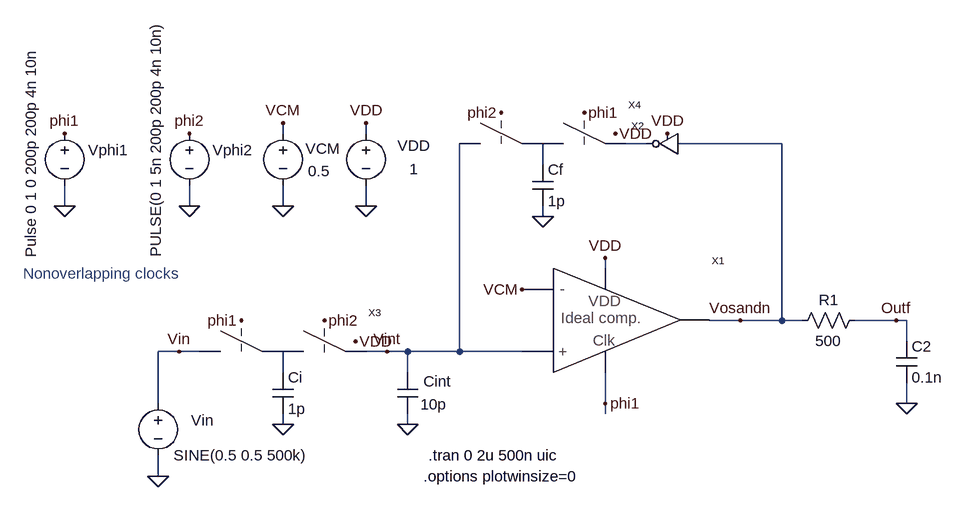
[diagram p0: schematic _Fig6_21_MSD.asc]
_Fig6_21_MSD.asc, the LTspice schematic file:
Version 4
SHEET 1 880 680
WIRE -400 -176 -400 -192
WIRE -272 -176 -272 -192
WIRE 160 -160 128 -160
WIRE 368 -160 208 -160
WIRE 0 -128 0 -160
WIRE -736 -64 -736 -96
WIRE -544 -64 -544 -96
WIRE -400 -64 -400 -96
WIRE -272 -64 -272 -96
WIRE 0 -48 0 -64
WIRE 96 32 96 16
WIRE 304 112 256 112
WIRE 368 112 368 -160
WIRE 368 112 304 112
WIRE 400 112 368 112
WIRE 544 112 480 112
WIRE 560 112 544 112
WIRE 560 144 560 112
WIRE -560 160 -592 160
WIRE -528 160 -560 160
WIRE -240 160 -272 160
WIRE -208 160 -240 160
WIRE -128 160 -128 -160
WIRE -128 160 -208 160
WIRE -32 160 -128 160
WIRE -400 192 -400 160
WIRE -208 192 -208 160
WIRE -592 240 -592 160
WIRE 96 240 96 192
WIRE 560 240 560 208
WIRE 96 256 96 240
WIRE -400 272 -400 256
WIRE -208 272 -208 256
WIRE -592 352 -592 320
FLAG -272 -64 0
FLAG 96 16 VDD
FLAG -272 -192 VDD
FLAG -400 -64 0
FLAG -400 -192 VCM
FLAG 304 112 Vosandn
FLAG -208 272 0
FLAG -592 352 0
FLAG -560 160 Vin
FLAG -240 160 Vint
FLAG 560 240 0
FLAG 544 112 Outf
FLAG -32 64 VCM
FLAG 192 -176 VDD
FLAG 0 -48 0
FLAG -400 272 0
FLAG 112 -176 VDD
FLAG -288 144 VDD
FLAG -736 -64 0
FLAG -736 -176 phi1
FLAG -544 -64 0
FLAG -544 -176 phi2
FLAG -464 112 phi1
FLAG 64 -208 phi1
FLAG -64 -208 phi2
FLAG -336 112 phi2
FLAG 96 240 phi1
SYMBOL Ideal_clocked_comparator 16 112 R0
SYMATTR InstName X1
SYMBOL voltage -272 -192 R0
WINDOW 0 48 35 Left 0
WINDOW 3 67 71 Left 0
SYMATTR InstName VDD
SYMATTR Value 1
SYMBOL voltage -400 -192 R0
WINDOW 0 35 39 Left 0
WINDOW 3 39 74 Left 0
SYMATTR InstName VCM
SYMATTR Value 0.5
SYMBOL cap -224 192 R0
WINDOW 0 40 14 Left 0
WINDOW 3 36 49 Left 0
SYMATTR InstName Cint
SYMATTR Value 10p
SYMBOL voltage -592 224 R0
WINDOW 0 51 42 Left 0
WINDOW 123 0 0 Left 0
WINDOW 39 0 0 Left 0
SYMATTR InstName Vin
SYMATTR Value SINE(0.5 0.5 500k)
SYMBOL res 496 96 R90
WINDOW 0 0 56 VBottom 0
WINDOW 3 32 56 VTop 0
SYMATTR InstName R1
SYMATTR Value 500
SYMBOL cap 544 144 R0
SYMATTR InstName C2
SYMATTR Value 0.1n
SYMBOL inverter 208 -160 M0
SYMATTR InstName X2
SYMBOL switches_2 -528 176 R0
SYMATTR InstName X3
SYMBOL switches_2 -128 -144 R0
SYMATTR InstName X4
SYMBOL cap -416 192 R0
SYMATTR InstName Ci
SYMATTR Value 1p
SYMBOL cap -16 -128 R0
SYMATTR InstName Cf
SYMATTR Value 1p
SYMBOL voltage -736 -192 R0
WINDOW 0 36 42 Left 0
WINDOW 3 -52 207 VLeft 0
WINDOW 123 0 0 Left 0
WINDOW 39 0 0 Left 0
SYMATTR InstName Vphi1
SYMATTR Value Pulse 0 1 0 200p 200p 4n 10n
SYMBOL voltage -544 -192 R0
WINDOW 0 36 42 Left 0
WINDOW 3 -52 207 VLeft 0
WINDOW 123 0 0 Left 0
WINDOW 39 0 0 Left 0
SYMATTR InstName Vphi2
SYMATTR Value PULSE(0 1 5n 200p 200p 4n 10n)
TEXT -176 320 Left 0 !.tran 0 2u 500n uic
TEXT -184 352 Left 0 !.options plotwinsize=0
TEXT -800 40 Left 0 ;Nonoverlapping clocks

The netlist it stands for:
* _Fig6_21_MSD.asc
XX1 VCM Vint Vosandn VDD phi1 Ideal_clocked_comparator  ; pins Vinm Vinp Vout VDD Clock
VDD VDD 0 1
VCM VCM 0 0.5
Cint Vint 0 10p
Vin Vin 0 SINE(0.5 0.5 500k)
R1 Outf Vosandn 500
C2 Outf 0 0.1n
XX2 Vosandn N001 VDD inverter  ; pins In Out VDD
XX3 Vin phi1 phi2 Vint VDD N003 switches_2  ; pins P1 clk1 Clk2 P3 VDD P2
XX4 Vint phi2 phi1 N001 VDD N002 switches_2  ; pins P1 clk1 Clk2 P3 VDD P2
Ci N003 0 1p
Cf N002 0 1p
Vphi1 phi1 0 Pulse 0 1 0 200p 200p 4n 10n
Vphi2 phi2 0 PULSE(0 1 5n 200p 200p 4n 10n)
.tran 0 2u 500n uic
.options plotwinsize=0
* Nonoverlapping clocks
.backanno
.end